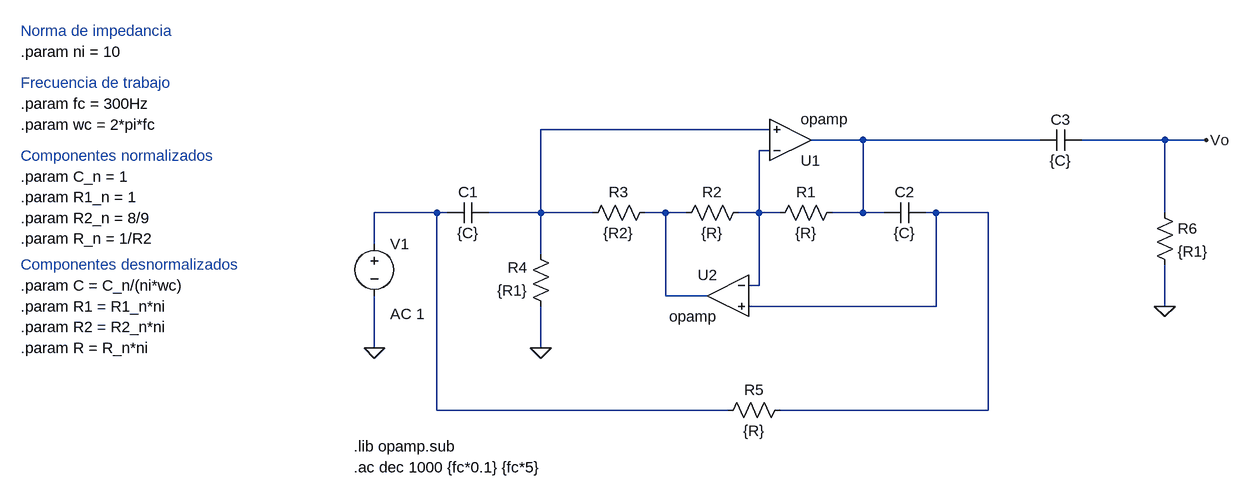
[diagram p0: schematic TS5_a.asc]
TS5_a.asc, the LTspice schematic file:
Version 4
SHEET 1 880 680
WIRE 160 80 -192 80
WIRE 304 96 224 96
WIRE 576 96 304 96
WIRE 768 96 640 96
WIRE 832 96 768 96
WIRE 160 112 144 112
WIRE -352 208 -448 208
WIRE -336 208 -352 208
WIRE -192 208 -192 80
WIRE -192 208 -272 208
WIRE -112 208 -192 208
WIRE 0 208 -32 208
WIRE 32 208 0 208
WIRE 144 208 144 112
WIRE 144 208 112 208
WIRE 176 208 144 208
WIRE 304 208 304 96
WIRE 304 208 256 208
WIRE 336 208 304 208
WIRE 416 208 400 208
WIRE 496 208 416 208
WIRE 768 208 768 96
WIRE -448 256 -448 208
WIRE -192 272 -192 208
WIRE 144 320 144 208
WIRE 144 320 128 320
WIRE 0 336 0 208
WIRE 64 336 0 336
WIRE 416 352 416 208
WIRE 416 352 128 352
WIRE 768 352 768 288
WIRE -448 416 -448 336
WIRE -192 416 -192 352
WIRE -352 512 -352 208
WIRE 96 512 -352 512
WIRE 496 512 496 208
WIRE 496 512 176 512
FLAG -192 416 0
FLAG -448 416 0
FLAG 768 352 0
FLAG 832 96 Vo
SYMBOL OpAmps\\opamp 192 160 M180
SYMATTR InstName U1
SYMBOL OpAmps\\opamp 96 272 M0
SYMATTR InstName U2
SYMBOL res 272 192 R90
WINDOW 0 0 56 VBottom 2
WINDOW 3 32 56 VTop 2
SYMATTR InstName R1
SYMATTR Value {R}
SYMBOL res 128 192 R90
WINDOW 0 0 56 VBottom 2
WINDOW 3 32 56 VTop 2
SYMATTR InstName R2
SYMATTR Value {R}
SYMBOL res -16 192 R90
WINDOW 0 0 56 VBottom 2
WINDOW 3 32 56 VTop 2
SYMATTR InstName R3
SYMATTR Value {R2}
SYMBOL res -176 368 R180
WINDOW 0 36 76 Left 2
WINDOW 3 36 40 Left 2
SYMATTR InstName R4
SYMATTR Value {R1}
SYMBOL cap -272 192 R90
WINDOW 0 0 32 VBottom 2
WINDOW 3 32 32 VTop 2
SYMATTR InstName C1
SYMATTR Value {C}
SYMBOL cap 400 192 R90
WINDOW 0 0 32 VBottom 2
WINDOW 3 32 32 VTop 2
SYMATTR InstName C2
SYMATTR Value {C}
SYMBOL res 192 496 R90
WINDOW 0 0 56 VBottom 2
WINDOW 3 32 56 VTop 2
SYMATTR InstName R5
SYMATTR Value {R}
SYMBOL voltage -448 240 R0
WINDOW 123 24 124 Left 2
WINDOW 39 0 0 Left 0
SYMATTR Value2 AC 1
SYMATTR InstName V1
SYMATTR Value ""
SYMBOL cap 640 80 R90
WINDOW 0 0 32 VBottom 2
WINDOW 3 32 32 VTop 2
SYMATTR InstName C3
SYMATTR Value {C}
SYMBOL res 752 192 R0
SYMATTR InstName R6
SYMATTR Value {R1}
TEXT -480 568 Left 2 !.lib opamp.sub
TEXT -480 600 Left 2 !.ac dec 1000 {fc*0.1} {fc*5}
TEXT -992 40 Left 2 !.param fc = 300Hz
TEXT -992 72 Left 2 !.param wc = 2*pi*fc
TEXT -992 8 Left 2 ;Frecuencia de trabajo
TEXT -992 120 Left 2 ;Componentes normalizados
TEXT -992 152 Left 2 !.param C_n = 1
TEXT -992 184 Left 2 !.param R1_n = 1
TEXT -992 216 Left 2 !.param R2_n = 8/9
TEXT -992 248 Left 2 !.param R_n = 1/R2
TEXT -992 288 Left 2 ;Componentes desnormalizados
TEXT -992 -72 Left 2 ;Norma de impedancia
TEXT -992 -40 Left 2 !.param ni = 10
TEXT -992 320 Left 2 !.param C = C_n/(ni*wc)
TEXT -992 352 Left 2 !.param R1 = R1_n*ni
TEXT -992 384 Left 2 !.param R2 = R2_n*ni
TEXT -992 416 Left 2 !.param R = R_n*ni

The netlist it stands for:
* TS5_a.asc
XU1 N003 N001 N002 opamp Aol=100K GBW=10Meg  ; pins invin noninvin out
XU2 N003 N006 N005 opamp Aol=100K GBW=10Meg  ; pins invin noninvin out
R1 N002 N003 {R}
R2 N003 N005 {R}
R3 N005 N001 {R2}
R4 0 N001 {R1}
C1 N001 N004 {C}
C2 N006 N002 {C}
R5 N006 N004 {R}
V1 N004 0 AC 1
C3 Vo N002 {C}
R6 Vo 0 {R1}
.lib opamp.sub
.ac dec 1000 {fc*0.1} {fc*5}
.param fc = 300Hz
.param wc = 2*pi*fc
* Frecuencia de trabajo
* Componentes normalizados
.param C_n = 1
.param R1_n = 1
.param R2_n = 8/9
.param R_n = 1/R2
* Componentes desnormalizados
* Norma de impedancia
.param ni = 10
.param C = C_n/(ni*wc)
.param R1 = R1_n*ni
.param R2 = R2_n*ni
.param R = R_n*ni
.backanno
.end